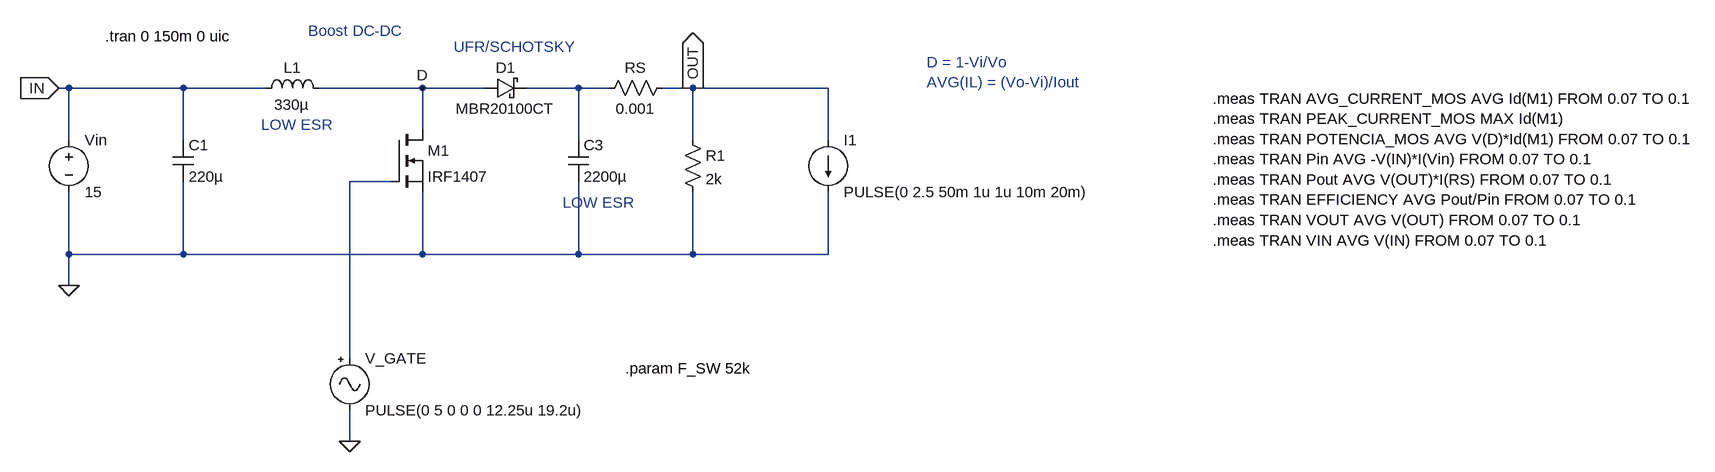
[diagram p0: schematic smps_boost_CCM.asc]
smps_boost_CCM.asc, the LTspice schematic file:
Version 4
SHEET 1 1596 680
WIRE -1024 -352 -1040 -352
WIRE -848 -352 -1024 -352
WIRE -720 -352 -848 -352
WIRE -480 -352 -640 -352
WIRE -384 -352 -480 -352
WIRE -240 -352 -320 -352
WIRE -192 -352 -240 -352
WIRE -64 -352 -112 -352
WIRE 144 -352 -64 -352
WIRE -480 -288 -480 -352
WIRE -1024 -272 -1024 -352
WIRE -848 -272 -848 -352
WIRE -240 -272 -240 -352
WIRE -64 -272 -64 -352
WIRE 144 -272 144 -352
WIRE -528 -208 -592 -208
WIRE -1024 -96 -1024 -192
WIRE -848 -96 -848 -208
WIRE -848 -96 -1024 -96
WIRE -480 -96 -480 -192
WIRE -480 -96 -848 -96
WIRE -240 -96 -240 -208
WIRE -240 -96 -480 -96
WIRE -64 -96 -64 -192
WIRE -64 -96 -240 -96
WIRE 144 -96 144 -192
WIRE 144 -96 -64 -96
WIRE -1024 -48 -1024 -96
WIRE -592 64 -592 -208
WIRE -592 192 -592 144
FLAG -1024 -48 0
FLAG -592 192 0
FLAG -64 -352 OUT
IOPIN -64 -352 Out
FLAG -480 -352 D
FLAG -1040 -352 IN
IOPIN -1040 -352 In
SYMBOL cap -864 -272 R0
SYMATTR InstName C1
SYMATTR Value 220µ
SYMBOL ind -736 -336 R270
WINDOW 0 32 56 VTop 2
WINDOW 3 -25 55 VTop 2
SYMATTR InstName L1
SYMATTR Value 330µ
SYMATTR SpiceLine Rser=0.001
SYMBOL schottky -384 -336 R270
WINDOW 0 32 32 VTop 2
WINDOW 3 0 32 VBottom 2
SYMATTR InstName D1
SYMATTR Value MBR20100CT
SYMBOL cap -256 -272 R0
SYMATTR InstName C3
SYMATTR Value 2200µ
SYMBOL nmos -528 -288 R0
SYMATTR InstName M1
SYMATTR Value IRF1407
SYMBOL Misc\\signal -592 48 R0
WINDOW 123 0 0 Left 2
WINDOW 39 0 0 Left 2
SYMATTR InstName V_GATE
SYMATTR Value PULSE(0 5 0 0 0 12.25u 19.2u)
SYMBOL voltage -1024 -288 R0
SYMATTR InstName Vin
SYMATTR Value 15
SYMBOL current 144 -272 R0
WINDOW 123 0 0 Left 2
WINDOW 39 0 0 Left 2
SYMATTR InstName I1
SYMATTR Value PULSE(0 2.5 50m 1u 1u 10m 20m)
SYMBOL res -96 -368 R90
WINDOW 0 0 56 VBottom 2
WINDOW 3 32 56 VTop 2
SYMATTR InstName RS
SYMATTR Value 0.001
SYMBOL res -80 -288 R0
SYMATTR InstName R1
SYMATTR Value 2k
TEXT -968 -432 Left 2 !.tran 0 150m 0 uic
TEXT 736 -336 Left 2 !.meas TRAN AVG_CURRENT_MOS AVG Id(M1) FROM 0.07 TO 0.1\n.meas TRAN PEAK_CURRENT_MOS MAX Id(M1)\n.meas TRAN POTENCIA_MOS AVG V(D)*Id(M1) FROM 0.07 TO 0.1\n.meas TRAN Pin AVG -V(IN)*I(Vin) FROM 0.07 TO 0.1\n.meas TRAN Pout AVG V(OUT)*I(RS) FROM 0.07 TO 0.1\n.meas TRAN EFFICIENCY AVG Pout/Pin FROM 0.07 TO 0.1\n.meas TRAN VOUT AVG V(OUT) FROM 0.07 TO 0.1\n.meas TRAN VIN AVG V(IN) FROM 0.07 TO 0.1
TEXT -168 80 Left 2 !.param F_SW 52k
TEXT -656 -440 Left 2 ;Boost DC-DC
TEXT 296 -392 Left 2 ;D = 1-Vi/Vo\nAVG(IL) = (Vo-Vi)/Iout
TEXT -264 -176 Left 2 ;LOW ESR
TEXT -432 -416 Left 2 ;UFR/SCHOTSKY
TEXT -728 -296 Left 2 ;LOW ESR

The netlist it stands for:
* smps_boost_CCM.asc
C1 IN 0 220µ
L1 IN D 330µ Rser=0.001
D1 D N001 MBR20100CT
C3 N001 0 2200µ
M1 D N002 0 0 IRF1407
V_GATE N002 0 PULSE(0 5 0 0 0 12.25u 19.2u)
Vin IN 0 15
I1 OUT 0 PULSE(0 2.5 50m 1u 1u 10m 20m)
RS OUT N001 0.001
R1 OUT 0 2k
.model D D
.lib standard.dio
.model NMOS NMOS
.model PMOS PMOS
.lib standard.mos
.tran 0 150m 0 uic
.meas TRAN AVG_CURRENT_MOS AVG Id(M1) FROM 0.07 TO 0.1
.meas TRAN PEAK_CURRENT_MOS MAX Id(M1)
.meas TRAN POTENCIA_MOS AVG V(D)*Id(M1) FROM 0.07 TO 0.1
.meas TRAN Pin AVG -V(IN)*I(Vin) FROM 0.07 TO 0.1
.meas TRAN Pout AVG V(OUT)*I(RS) FROM 0.07 TO 0.1
.meas TRAN EFFICIENCY AVG Pout/Pin FROM 0.07 TO 0.1
.meas TRAN VOUT AVG V(OUT) FROM 0.07 TO 0.1
.meas TRAN VIN AVG V(IN) FROM 0.07 TO 0.1
.param F_SW 52k
* Boost DC-DC
* D = 1-Vi/Vo
* AVG(IL) = (Vo-Vi)/Iout
* LOW ESR
* UFR/SCHOTSKY
* LOW ESR
.backanno
.end